# EAGLE design simpleledboard (EAGLE 8.4.3)
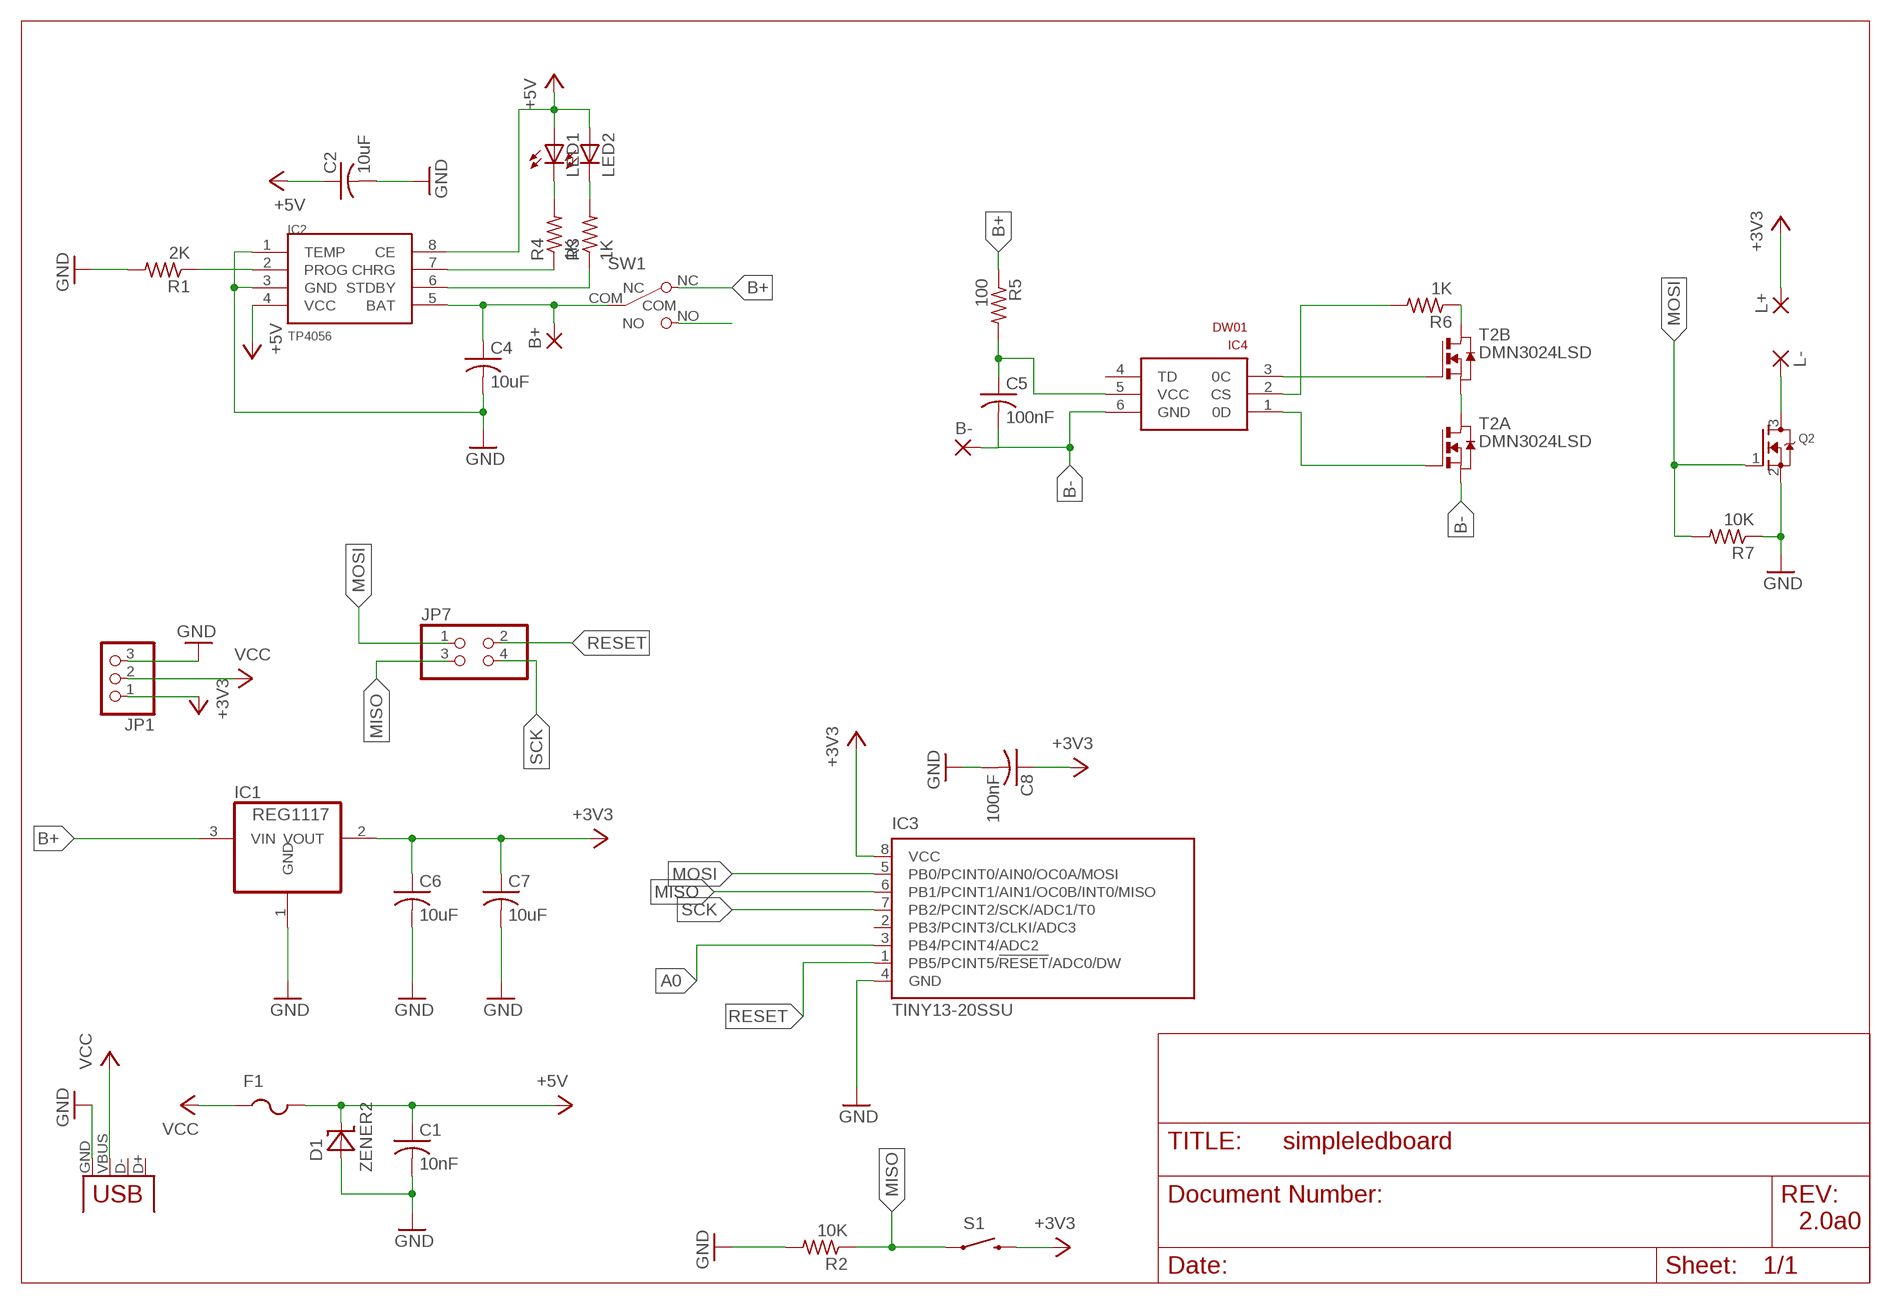
[diagram p0: schematic, sheet 1]

## Parts
B+  WIREPADSMD1,27-254  [SMD1,27-2,54]
B-  WIREPADSMD1,27-254  [SMD1,27-2,54]
C1  10nF  C-USC0603  [C0603]
C2  10uF  C-USC0603  [C0603]
C4  10uF  C-USC0603  [C0603]
C5  100nF  C-USC0603  [C0603]
C6  10uF  C-USC0603  [C0603]
C7  10uF  C-USC0603  [C0603]
C8  100nF  C-USC0603  [C0603]
D1  ZENER2  [SOD123]
F1  PTCFUSE-1206  [R1206]
IC1  REG1117  [SOT223]
IC2  TP4056  [SOP-8]
IC3  TINY13-20SSU  [8S1]
IC4  DW01  [SOT23-6]
JP1  PINHD-1X3CB  [1X03-CLEANBIG]
JP7  PINHD-2X2  [2X02]
L+  SMD2  [SMD1,27-2,54]
L-  SMD2  [SMD1,27-2,54]
LED1  LED0603  [LED-0603]
LED2  LED0603  [LED-0603]
Q2  MOSFET-NREFLOW  [SOT23]
R1  2K  R-US_R0603  [R0603]
R2  10K  R-US_R0603  [R0603]
R3  1K  R-US_R0603  [R0603]
R4  1K  R-US_R0603  [R0603]
R5  100  R-US_R1206  [R1206]
R6  1K  R-US_R0603  [R0603]
R7  10K  R-US_R0603  [R0603]
S1  SWITCH-MOMENTARY-2SMD-4.6X2.8MM  [TACTILE_SWITCH_SMD_4.6X2.8MM]
SW1  SW_SLIDE  [SLIDE_SWITCH_SMD]
T2  DMN3024LSD  [TSSOP-8]
X2  USB-MICROB  [USB-MICROB]

## Nets
+3V3: C6.1 C7.1 C8.1 IC1.2(VOUT) IC3.8(VCC) JP1.1 L+.1(P) S1.3 S1.4
+5V: C1.1 C2.1 D1.C F1.2 IC2.4(VCC) IC2.8(CE) LED1.A LED2.A
A0: IC3.3(PB4/PCINT4/ADC2)
B+: IC1.3(VIN) R5.1 SW1.NC
B+TMP: B+.1(P) C4.1 IC2.5(BAT) SW1.COM
B-: B-.1(P) C5.2 IC4.6(GND) T2.2(A:S) T2.3(A:S)
GND: C1.2 C2.2 C4.2 C6.2 C7.2 C8.2 D1.A IC1.1(GND) IC2.1(TEMP) IC2.3(GND) IC3.4(GND) JP1.3 Q2.2(S) R1.2 R2.2 R7.1 X2.GND
MISO: IC3.6(PB1/PCINT1/AIN1/OC0B/INT0/MISO) JP7.3 R2.1 S1.1 S1.2
MOSI: IC3.5(PB0/PCINT0/AIN0/OC0A/MOSI) JP7.1 Q2.1(G) R7.2
N$1: IC2.7(CHRG) R4.1
N$2: IC4.1(0D) T2.4(A:G)
N$3: T2.1(A:D) T2.6(B:S) T2.7(B:S)
N$4: LED1.C R4.2
N$5: IC4.3(0C) T2.5(B:G)
N$6: IC4.2(CS) R6.2
N$7: C5.1 IC4.5(VCC) R5.2
N$8: R6.1 T2.8(B:D)
N$9: L-.1(P) Q2.3(D)
N$10: SW1.NO
N$11: LED2.C R3.2
N$12: IC2.6(STDBY) R3.1
N$14: IC2.2(PROG) R1.1
RESET: IC3.1(PB5/PCINT5/!RESET!/ADC0/DW) JP7.2
SCK: IC3.7(PB2/PCINT2/SCK/ADC1/T0) JP7.4
VCC: F1.1 JP1.2 X2.VBUS
Unconnected: IC3.2(PB3/PCINT3/CLKI/ADC3) IC4.4(TD) X2.D+ X2.D-

## Notes on the sheet
- 2.0a0

## Library data of the parts
B+ B- = wirepad:WIREPAD: Wire PAD connect wire on PCB
C1 C2 C4-C8 = adafruit:C-US: CAPACITOR, American symbol
D1 = smt_diodes:ZENER
F1 = adafruit:PTCFUSE: PTC fuses, resettable thermistors
IC1 = burr-brown:REG1117: 800mA and 1A Low Dropout (LDO) Positive Regulator 1.8V, 2.5V, 2.85V, 3.3V, 5V, and Adj; MPN: REG1117; OC_FARNELL: 1097566; OC_NEWARK: 14P6981
IC2 = TP4056:TP4056
IC3 = atmel:TINY13: 8-bit AVR Microcontroller with 1K Bytes In-System Programmable Flash Source: http://www.atmel.com/dyn/resources/prod_documents/2535S.pdf; MPN: ATTINY13-20SSU; OC_FARNELL: 1455133; OC_NEWARK: 58M3771
IC4 = DW01:DW01: The DW01-P battery protection IC is designed to protect lithium-ion/polymer battery from damage or degrading the lifetime due to overcharge, overdischarge, and/or overcurrent for one-cell lithium-ion/polymer battery powered systems, such as cellular phones. Data sheet <http://goo.gl/4y108d> Dave.Calaway Eagle Library <https://goo.gl/Muy1Tr>
JP1 = adafruit:PINHD-1X3: PIN HEADER
JP7 = pinhead:PINHD-2X2: PIN HEADER
L+ L- = wirepad:SMD2: SMD PAD
LED1 LED2 = SparkFun:LED: LEDs Standard schematic elements and footprints for 5mm, 3mm, 1206, and 0603 sized LEDs. 5mm - Spark Fun Electronics SKU : COM-00529 (and others)
Q2 = adafruit:MOSFET-N: N-Channel Mosfet 2N7002E - 60V 260mA SOT23 [Digikey: 2N7002ET1GOSTR-ND] - REEL BSH103 - 30V 850mA SOT23 [Digikey: 568-5013-1-ND]
R1-R7 = adafruit:R-US_: RESISTOR, American symbol
S1 = SparkFun-Electromechanical:SWITCH-MOMENTARY-2: Various NO switches- pushbuttons, reed, etc; PROD_ID: SWCH-13065
SW1 = dp_devices:SW_SLIDE
T2 = FS8205A:DMN3024LSD: DUAL N-CHANNEL ENHANCEMENT MODE MOSFET data sheet <http://goo.gl/dRgboR> Dave.Calaway Eagle Library <https://goo.gl/Muy1Tr>
X2 = SparkFun:USB: USB Connectors USB-B-PTH is fully proven SKU : PRT-00139 USB-miniB is fully proven SKU : PRT-00587 USB-A-PCB is untested. USB-A-H is throughly reviewed, but untested. Spark Fun Electronics SKU : PRT-00437 USB-B-SMT is throughly reviewed, but untested. Needs silkscreen touching up. USB-A-S has not been used/tested USB-MB-H has not been used/tested

## Board
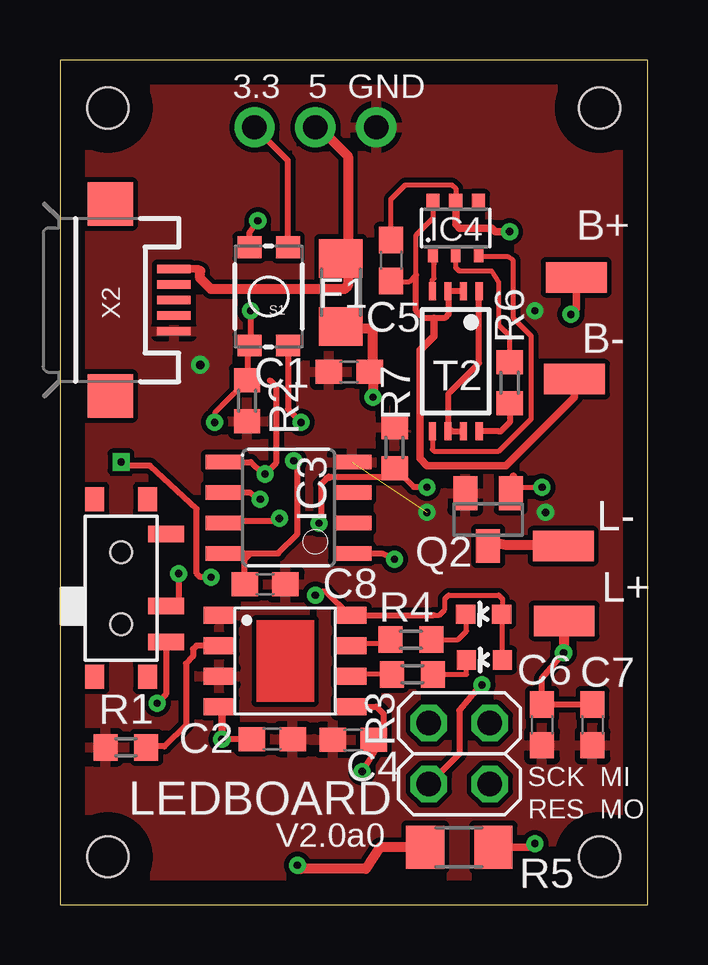
[diagram p1: board, top side]
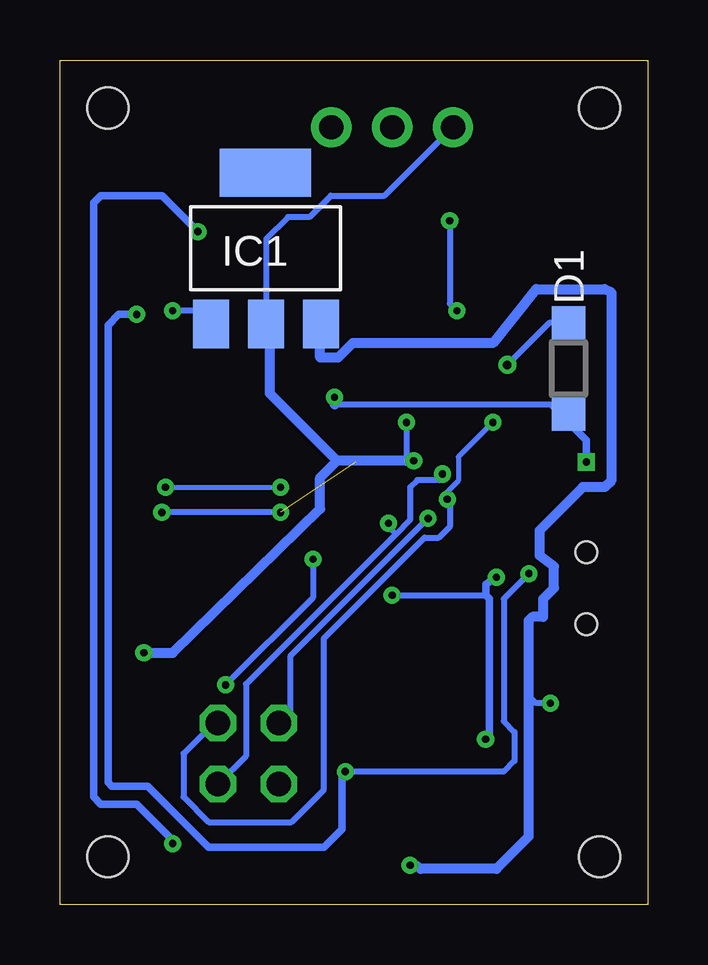
[diagram p2: board, bottom side, seen from below]

Size 24.5 x 35.2 mm. Coordinates in mm from the lower left corner, seen from the top.
Outline: 0,0 24.5,0 24.5,35.2 0,35.2 0,0
Copper layers (1*16): Top 0.035mm / dielectric 1.5mm / Bottom 0.035mm
Design rules "default *": minimum track width 10mil, minimum drill 24mil, track to track 8mil, track to pad 8mil, pad to pad 8mil, via to via 8mil, smd to smd 8mil, copper to edge 40mil, drill to drill 8mil, minimum pad ring 10mil, minimum via ring 8mil, stop-mask expansion 4mil, vias tented up to drill 15mil, thermal gap 10mil
Holes 1.7 mm at 2,2 22.5,2 22.5,33.2 2,33.2

### Footprints (pad centres in the part's own frame; a part is rotated, then mirrored left to right if it is on the bottom)
SMD1,27-2,54 = smd 1.27 x 2.54: 1 0,0
C0603 = smd 1.1 x 1: 1 -0.85,0; 2 0.85,0
SOD123 = smd 1.4 x 1.4: A 1.9,0; C -1.9,0
R1206 = smd 1.6 x 1.803: 1 -1.422,0; 2 1.422,0
SOT223 = smd 1.499 x 2.007: 1 -2.261,-3.15; 2 0.025,-3.15; 3 2.311,-3.15 | smd 3.81 x 2.007: 4 0,3.15
SOP-8 = smd 1.3 x 0.7: 1 -2.75,1.905; 2 -2.75,0.635; 3 -2.75,-0.635; 4 -2.75,-1.905; 5 2.75,-1.905; 6 2.75,-0.635; 7 2.75,0.635; 8 2.75,1.905
8S1 = smd 0.6 x 1.6: 1 -1.905,-2.654; 2 -0.645,-2.654; 3 0.625,-2.654; 4 1.895,-2.654; 5 1.905,2.654; 6 0.635,2.654; 7 -0.635,2.654; 8 -1.905,2.654
SOT23-6 = smd 0.4 x 0.55: 1 -0.95,-1.15; 2 0,-1.15; 3 0.95,-1.15 | smd 0.55 x 0.55: 4 0.95,1.15; 5 0,1.15; 6 -0.95,1.15
1X03-CLEANBIG = drill 1.016 pad 1.676: 1 -2.54,0; 2 0,0; 3 2.54,0
2X02 = drill 1.016 octagon: 1 -1.27,-1.27; 2 -1.27,1.27; 3 1.27,-1.27; 4 1.27,1.27
LED-0603 = smd 0.8 x 0.8: A 0,-0.75; C 0,0.75
SOT23 = smd 1 x 1.4: 1 -0.95,-1.1; 2 0.95,-1.1; 3 0,1.1
R0603 = smd 1 x 1.1: 1 -0.85,0; 2 0.85,0
TACTILE_SWITCH_SMD_4.6X2.8MM = smd 0.9 x 1: 1 -2.05,-0.8; 2 2.05,-0.8; 3 2.05,0.8; 4 -2.05,0.8
SLIDE_SWITCH_SMD = smd 0.7 x 1.5: COM 0.75,1.875; NC 2.25,1.875; NO -2.25,1.875 | smd 1 x 0.8: P$1 -3.7,-1.1; P$2 -3.7,1.1; P$3 3.7,1.1; P$4 3.7,-1.1 | hole 0.9: -1.5,0; 1.5,0
TSSOP-8 = smd 0.3 x 0.75: 1 -0.975,-2.925; 2 -0.325,-2.925; 3 0.325,-2.925; 4 0.975,-2.925; 5 0.975,2.925; 6 0.325,2.925; 7 -0.325,2.925; 8 -0.975,2.925
USB-MICROB = smd 0.35 x 1.4: D+ 0,2.65; D- -0.65,2.65; GND 1.3,2.65; ID 0.65,2.65; VBUS -1.3,2.65 | smd 1.8 x 1.9: MT1 -4,0; MT2 4,0

### Placement (x,y rotation side)
B+  21.53,26.14 270 top
B-  21.45,21.9 90 top
C1  12.06,22.21 180 top
C2  8.85,6.9 0 top
C4  12.23,6.87 180 top
C5  13.8,26.85 270 top
C6  20.1,7.5 270 top
C7  22.2,7.5 270 top
C8  8.55,13.35 0 top
D1  3.3,22.35 90 bottom
F1  11.71,25.51 270 top
IC1  15.93,27.35 0 bottom
IC2  9.39,10.16 0 top
IC3  9.53,16.55 90 top
IC4  16.5,28.2 0 top
JP1  10.65,32.4 0 top
JP7  16.65,6.3 90 top
L+  21.02,11.83 90 top
L-  20.98,14.95 90 top
LED1  17.67,12.11 90 top
LED2  17.7,10.2 90 top
Q2  17.85,16.05 180 top
R1  2.75,6.56 180 top
R2  7.8,21 270 top
R3  14.7,9.6 0 top
R4  14.64,11.05 0 top
R5  16.65,2.4 0 top
R6  18.75,21.75 90 top
R7  13.95,19.05 270 top
S1  8.7,25.35 270 top
SW1  2.55,13.2 270 top
T2  16.5,22.65 180 top
X2  2.1,25.2 270 top

### Tracks (layer width: path | path; a pad name or v marks a point on that pad's centre or on a via)
+3V3  (via drill 0.3)
  Top 0.254: C7.1 C6.1 20.1,9.45 v21,10.5 | S1.4 9.5,31.01 JP1.1 | 9.45,23.1 9.6,23.2 S1.3 9.5,20.65 v10.05,20.1 | 7.7,14.64 IC3.8 | 7.7,14.64 7.95,14.64 | 7.95,14.64 9.1,14.64 9.9,15.45 9.9,18.35 v9.75,18.5 | 7.7,14.39 7.95,14.64 | C8.1 7.7,14.64
  Top 0.406: L+.1 21.02,10.67 v21,10.5
  Bottom 0.254: 16,24.3 IC1.2 | 15.75,24.05 IC1.2 | IC1.2 15.9,27.75 15,28.65 14.1,28.65 13.2,29.55 10.96,29.55 JP1.1 | v10.05,20.1 10.05,18.5
  Bottom 0.406: v9.75,18.5 10.05,18.5 12.95,18.5 | 12.95,18.5 15.75,21.3 15.75,24.05 | v21,10.5 19.8,10.5 13.65,16.5 13.65,17.8 12.95,18.5
+5V  (via drill 0.3)
  Top 0.205: LED2.A 18.45,12.08 LED1.A 18.45,12.14 18.45,12.75 18.3,12.9 16.2,12.9 16.05,12.75 16.05,12.3 15.81,12.06 15.58,12.06
  Top 0.254: 15.58,12.06 IC2.8 12.09,12.06 11.1,13.05 10.95,13.05 v10.65,12.9 | v6.3,13.65 5.85,13.65 5.7,13.8 5.7,16.5 3.75,18.3 2.7,18.3 v2.55,18.45 | C2.1 6.91,6.9 6.75,7.05
  Top 0.305: 2.46,18.36 v2.55,18.45 | v6.75,6.9 6.75,7.05 6.75,7.5 6.75,8.14 IC2.4 | C1.1 12.91,22.19 13.05,22.05
  Top 0.406: v13.05,21.15 13.05,22.05 13.05,23.85 12.9,24 11.8,24 F1.2
  Bottom 0.254: v10.65,12.9 6.75,12.9 | D1.C 3.58,20.38 4.05,20.85 13.05,20.85
  Bottom 0.305: v6.75,6.9 6.6,7.05 6.6,12.75 6.75,12.9 6.75,13.35 v6.3,13.65 | D1.C 3.3,20.1 2.55,19.35 v2.55,18.45
  Bottom 0.406: v13.05,21.15 13.05,20.85
A0
  Top 0.254: 12.26,17.1 IC3.3
B+  (via drill 0.3)
  Top 0.254: SW1.NC 4.42,8.78 v4.05,8.4
  Top 0.406: R5.1 13.35,2.4 12.75,1.5 10.05,1.5 v9.9,1.65
  Bottom 0.254: v4.05,8.4 4.65,8.4 4.95,8.7
  Bottom 0.406: v9.9,1.65 9.9,1.8 9.45,1.5 6.3,1.5 4.95,2.85 4.95,8.7 4.95,11.85 4.8,12 4.35,12 4.35,12.75 3.9,13.2 3.9,14.1 4.5,14.55 4.5,15.6 2.7,17.4 1.8,17.4 1.5,17.7 1.5,25.5 1.8,25.65 4.65,25.65 6.45,23.4 12.3,23.4 12.9,22.8 13.65,22.8 13.65,24.17 IC1.3
B+TMP  (via drill 0.3)
  Top 0.254: 4.42,12.68 SW1.COM 4.95,12.68 v4.95,13.8 | IC2.5 13.2,8.26 13.5,7.95 13.5,7.05 | 13.5,7.05 v12.6,5.55 | C4.1 13.32,6.87 13.5,7.05
  Top 0.305: B+.1 21.53,24.83 v21.3,24.6
  Bottom 0.254: v4.95,13.8 6,12.75 6,7.65 5.55,7.2 5.55,6 6,5.55 v12.6,5.55
  Bottom 0.305: v12.6,5.55 12.75,5.55 12.75,3.15 13.5,2.4 18.3,2.4 20.85,4.95 22.35,4.95 22.5,5.1 22.5,24.15 22.05,24.6 v21.3,24.6
B-
  Top 0.205: IC4.6 15.55,28.6 14.85,27.9 14.85,26.25 14.55,25.95 13.85,25.95 C5.2 | 16.2,25.57 T2.3
  Top 0.254: T2.2 16.2,25.57 | T2.3 16.2,25.55 16.2,24.6 16.05,24.45 15.6,24.45 15.15,24.45 14.85,24.75 14.85,26.25
  Top 0.305: B-.1 21.45,21.15 18.6,18.3 15.3,18.3 15,18.6 15,23.1 15.6,23.7 15.6,24.45
GND  (via drill 0.3, 0.35)  (1 unrouted)
  Top 0.254: Q2.2 16.9,16.75
  Bottom 0.254: IC1.1 18.54,24.75 v19.8,24.75 | v15.3,16.35 v20.25,16.35 | D1.A 4.1,24.25 v5.85,22.5
  pour Top: -1.2,37.45 -1.5,-1.25 25.7,-1.25 26,37.45
MISO  (via drill 0.3)
  Top 0.203: R2.1 6.45,20.5 v6.45,20.1
  Top 0.254: 6.81,17.25 IC3.6 7.92,17.18 v8.35,16.9 | R2.1 7.85,21.95 7.85,23.25 S1.2 7.95,23.35 v7.95,24.75 | S1.1 7.9,28 v8.25,28.5
  Bottom 0.203: v6.45,20.1 7.89,18.66 7.89,17.68 8.35,17.22 v8.35,16.9
  Bottom 0.254: JP7.3 18.08,7.57 19.35,6.3 19.35,4.5 18.3,3.45 14.85,3.45 13.5,4.8 13.5,11.1 9.3,15.3 8.7,15.3 8.25,15.75 8.25,16.85 v8.35,16.9 8.25,16.8 | v8.25,28.5 8.25,25.05 v7.95,24.75
MOSI  (via drill 0.3)
  Top 0.152: R7.2 13.97,18.18
  Top 0.203: Q2.1 19.05,17.4 v20.1,17.4 | 11.25,17.8 11.22,17.78 | 11.11,17.78 11.18,17.85 11.21,17.85
  Top 0.254: 6.92,18.5 IC3.5 6.9,18.45 7.95,18.45 8.4,18 v8.55,17.95 9,18.4 9,21.6 8.75,21.85 | v15.3,17.4 14.75,17.4 13.97,18.18 | 10.88,15.97 v10.8,15.9 | 10.88,15.97 10.88,15.98 | 11.22,17.78 11.11,17.78 | R7.2 13.55,17.8 11.25,17.8 | 11.21,17.85 10.88,17.51 10.88,15.97
  Top 0.305: 18.9,17.85 Q2.1
  Bottom 0.203: v20.1,17.4 v15.3,17.4 | v10.8,15.9 10.8,15.75 10.5,15.45
  Bottom 0.254: JP7.1 16.75,6.2 16.75,9.2 10.5,15.45 9.9,16.05 9.9,17.4 9.6,17.7 8.55,17.7 v8.55,17.95
N$1
  Top 0.205: 12.24,10.9 13.64,10.9 R4.1
  Top 0.254: 12.24,10.9 IC2.7
N$2
  Top 0.205: T2.4 15.53,26.02 15.6,26.1 15.6,26.7 IC4.1
N$3
  Top 0.205: 16.2,21.3 16.2,19.75 T2.6
  Top 0.254: T2.6 16.35,19.73 | 16.35,19.73 T2.7 | 16.35,19.73 16.2,19.88 16.2,21.3 17.48,22.57 T2.1
N$4
  Top 0.205: R4.2 16.6,11.05 16.95,11.4 16.95,12.08 LED1.C
N$5
  Top 0.205: T2.5 15.53,18.98 15.6,18.9 18.3,18.9 19.65,20.25 19.65,23.7 18.9,24.45 18.9,26.85 18.7,27 17.5,27 IC4.3
N$6
  Top 0.205: R6.2 18.75,23.7 18.3,24.15 18.3,25.95 18,26.4 16.65,26.4 16.5,26.55 IC4.2
N$7  (via drill 0.3)
  Top 0.205: C5.1 13.8,29.4 14.4,30 16.35,30 16.5,29.85 IC4.5
  Top 0.305: R5.2 19.65,2.4 v19.8,2.55 | v18.75,28.05 18.15,28.05 18,28.2 16.65,28.2 16.5,28.35 IC4.5
  Top 0.406: R5.2 18.15,2.4
  Bottom 0.305: v19.8,2.55 19.8,2.7 21.3,4.2 22.8,4.2 23.1,4.5 23.1,29.25 22.8,29.55 20.25,29.55 v18.75,28.05
N$8
  Top 0.205: 18.38,19.73 18.3,19.73 | 17.55,19.73 T2.8
  Top 0.254: R6.1 18.75,20.1 18.38,19.73 | 18.3,19.73 17.55,19.73
N$9
  Top 0.406: Q2.3 17.85,15.15 18.6,15 20.93,15 L-.1
N$11
  Top 0.205: R3.2 16.95,9.6 LED2.C
N$12
  Top 0.205: R3.1 12.21,9.6 IC2.6
N$13
  cutout Top: 11.7,26.25 15.6,26.25 15.6,19.95 13.95,19.95 13.8,24.6 11.7,24.6
N$14
  Top 0.254: IC2.2 5.7,10.79 5.55,10.65 5.55,10.35 5.25,10.05 5.25,7.5 4.35,6.6 3.64,6.6 R1.1
N$15
  cutout Top: 5.55,14.1 6.15,14.1 7.2,13.05 7.2,12.6 6,11.4 6,11.55 5.1,12.45 5.1,13.65
RESET  (via drill 0.3)
  Top 0.254: v17.59,9.16 17.56,9.16 16.65,8.1 16.65,6.3 JP7.2 | IC3.1 13.4,14.64 v13.95,14.4
  Bottom 0.254: v17.59,9.16 13.95,12.8 v13.95,14.4
SCK  (via drill 0.3)
  Top 0.254: IC3.7 6.96,16 9.05,16 v9.15,16.1 8.95,16.05
  Bottom 0.254: v9.15,16.1 14.9,10.35 14.9,8.05 JP7.4
VCC
  Top 0.205: 12,25.8 12,26.64 F1.1
  Top 0.305: X2.VBUS 5.75,26.5 5.85,26.4
  Top 0.406: JP1.2 10.8,32.4 12,31.2 12,25.8 11.85,25.65 6.3,25.65 5.85,26.1 5.85,26.4

### Text on the board
tPlace: 3.3 | 5 | GND | SCK | MI | LEDBOARD | RES | MO | V2.0a0